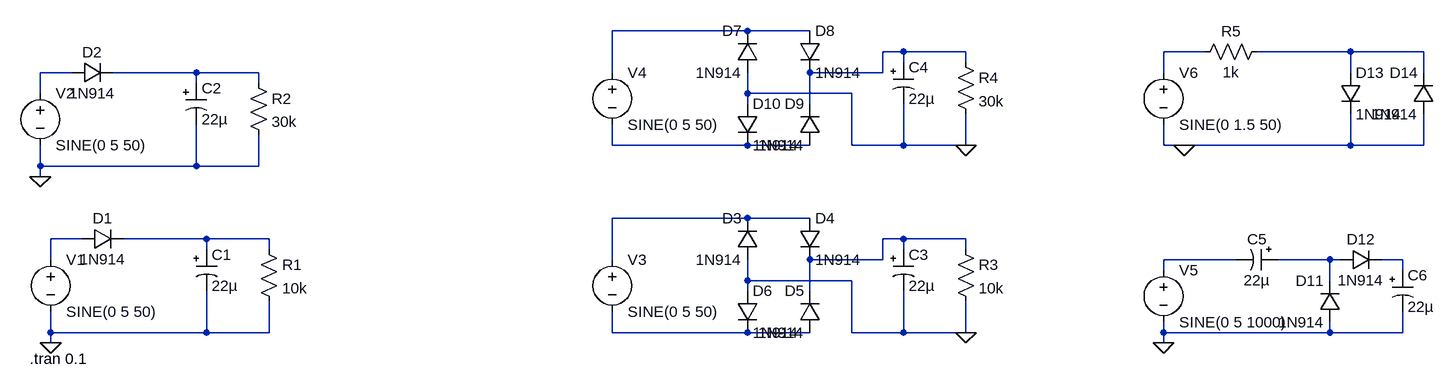
[diagram p0: schematic Lab2.asc]
Lab2.asc, the LTspice schematic file:
Version 4
SHEET 1 2436 680
WIRE 1040 -192 832 -192
WIRE 1136 -192 1040 -192
WIRE 1280 -160 1248 -160
WIRE 1376 -160 1280 -160
WIRE 1744 -160 1680 -160
WIRE 1968 -160 1824 -160
WIRE 2080 -160 1968 -160
WIRE 1280 -144 1280 -160
WIRE 1376 -144 1376 -160
WIRE 0 -128 -48 -128
WIRE 192 -128 64 -128
WIRE 288 -128 192 -128
WIRE 832 -128 832 -192
WIRE 1248 -128 1248 -160
WIRE 1248 -128 1136 -128
WIRE 1680 -128 1680 -160
WIRE 1968 -128 1968 -160
WIRE 2080 -128 2080 -160
WIRE 192 -112 192 -128
WIRE 288 -112 288 -128
WIRE -48 -96 -48 -128
WIRE 1040 -96 1040 -128
WIRE 1200 -96 1040 -96
WIRE 1040 -80 1040 -96
WIRE 1136 -80 1136 -128
WIRE 832 -16 832 -48
WIRE 1040 -16 832 -16
WIRE 1136 -16 1040 -16
WIRE 1200 -16 1200 -96
WIRE 1280 -16 1280 -80
WIRE 1280 -16 1200 -16
WIRE 1376 -16 1376 -64
WIRE 1376 -16 1280 -16
WIRE 1680 -16 1680 -48
WIRE 1712 -16 1680 -16
WIRE 1968 -16 1968 -64
WIRE 1968 -16 1712 -16
WIRE 2080 -16 2080 -64
WIRE 2080 -16 1968 -16
WIRE -48 16 -48 -16
WIRE 192 16 192 -48
WIRE 192 16 -48 16
WIRE 288 16 288 -32
WIRE 288 16 192 16
WIRE -48 32 -48 16
WIRE 1040 96 832 96
WIRE 1136 96 1040 96
WIRE 16 128 -32 128
WIRE 208 128 80 128
WIRE 304 128 208 128
WIRE 1280 128 1248 128
WIRE 1376 128 1280 128
WIRE 208 144 208 128
WIRE 304 144 304 128
WIRE 1280 144 1280 128
WIRE 1376 144 1376 128
WIRE -32 160 -32 128
WIRE 832 160 832 96
WIRE 1248 160 1248 128
WIRE 1248 160 1136 160
WIRE 1792 160 1680 160
WIRE 1936 160 1856 160
WIRE 1952 160 1936 160
WIRE 2048 160 2016 160
WIRE 1680 176 1680 160
WIRE 2048 176 2048 160
WIRE 1040 192 1040 160
WIRE 1200 192 1040 192
WIRE 1936 192 1936 160
WIRE 1040 208 1040 192
WIRE 1136 208 1136 160
WIRE -32 272 -32 240
WIRE 208 272 208 208
WIRE 208 272 -32 272
WIRE 304 272 304 224
WIRE 304 272 208 272
WIRE 832 272 832 240
WIRE 1040 272 832 272
WIRE 1136 272 1040 272
WIRE 1200 272 1200 192
WIRE 1280 272 1280 208
WIRE 1280 272 1200 272
WIRE 1376 272 1376 224
WIRE 1376 272 1280 272
WIRE 1680 272 1680 256
WIRE 1936 272 1936 256
WIRE 1936 272 1680 272
WIRE 2048 272 2048 240
WIRE 2048 272 1936 272
WIRE -32 288 -32 272
WIRE 1680 288 1680 272
FLAG -32 288 0
FLAG -48 32 0
FLAG 1376 272 0
FLAG 1376 -16 0
FLAG 1680 288 0
FLAG 1712 -16 0
SYMBOL voltage -32 144 R0
WINDOW 123 0 0 Left 0
WINDOW 39 0 0 Left 0
SYMATTR InstName V1
SYMATTR Value SINE(0 5 50)
SYMBOL diode 16 144 R270
WINDOW 0 32 32 VTop 2
WINDOW 3 0 32 VBottom 2
SYMATTR InstName D1
SYMATTR Value 1N914
SYMBOL res 288 128 R0
SYMATTR InstName R1
SYMATTR Value 10k
SYMBOL polcap 192 144 R0
WINDOW 3 24 56 Left 2
SYMATTR Value 22µ
SYMATTR InstName C1
SYMATTR Description Capacitor
SYMATTR Type cap
SYMATTR SpiceLine V=16 Irms=0 Rser=1.6 Lser=0 mfg="AVX" pn="TAJC226K016" type="Tantalum"
SYMBOL voltage -48 -112 R0
WINDOW 123 0 0 Left 0
WINDOW 39 0 0 Left 0
SYMATTR InstName V2
SYMATTR Value SINE(0 5 50)
SYMBOL diode 0 -112 R270
WINDOW 0 32 32 VTop 2
WINDOW 3 0 32 VBottom 2
SYMATTR InstName D2
SYMATTR Value 1N914
SYMBOL res 272 -128 R0
SYMATTR InstName R2
SYMATTR Value 30k
SYMBOL polcap 176 -112 R0
WINDOW 3 24 56 Left 2
SYMATTR Value 22µ
SYMATTR InstName C2
SYMATTR Description Capacitor
SYMATTR Type cap
SYMATTR SpiceLine V=16 Irms=0 Rser=1.6 Lser=0 mfg="AVX" pn="TAJC226K016" type="Tantalum"
SYMBOL voltage 832 144 R0
WINDOW 123 0 0 Left 0
WINDOW 39 0 0 Left 0
SYMATTR InstName V3
SYMATTR Value SINE(0 5 50)
SYMBOL diode 1056 160 R180
WINDOW 0 24 64 Left 2
WINDOW 3 24 0 Left 2
SYMATTR InstName D3
SYMATTR Value 1N914
SYMBOL res 1360 128 R0
SYMATTR InstName R3
SYMATTR Value 10k
SYMBOL polcap 1264 144 R0
WINDOW 3 24 56 Left 2
SYMATTR Value 22µ
SYMATTR InstName C3
SYMATTR Description Capacitor
SYMATTR Type cap
SYMATTR SpiceLine V=16 Irms=0 Rser=1.6 Lser=0 mfg="AVX" pn="TAJC226K016" type="Tantalum"
SYMBOL diode 1120 96 R0
SYMATTR InstName D4
SYMATTR Value 1N914
SYMBOL diode 1152 272 R180
WINDOW 0 24 64 Left 2
WINDOW 3 24 0 Left 2
SYMATTR InstName D5
SYMATTR Value 1N914
SYMBOL diode 1024 208 R0
SYMATTR InstName D6
SYMATTR Value 1N914
SYMBOL voltage 832 -144 R0
WINDOW 123 0 0 Left 0
WINDOW 39 0 0 Left 0
SYMATTR InstName V4
SYMATTR Value SINE(0 5 50)
SYMBOL diode 1056 -128 R180
WINDOW 0 24 64 Left 2
WINDOW 3 24 0 Left 2
SYMATTR InstName D7
SYMATTR Value 1N914
SYMBOL res 1360 -160 R0
SYMATTR InstName R4
SYMATTR Value 30k
SYMBOL polcap 1264 -144 R0
WINDOW 3 24 56 Left 2
SYMATTR Value 22µ
SYMATTR InstName C4
SYMATTR Description Capacitor
SYMATTR Type cap
SYMATTR SpiceLine V=16 Irms=0 Rser=1.6 Lser=0 mfg="AVX" pn="TAJC226K016" type="Tantalum"
SYMBOL diode 1120 -192 R0
SYMATTR InstName D8
SYMATTR Value 1N914
SYMBOL diode 1152 -16 R180
WINDOW 0 24 64 Left 2
WINDOW 3 24 0 Left 2
SYMATTR InstName D9
SYMATTR Value 1N914
SYMBOL diode 1024 -80 R0
SYMATTR InstName D10
SYMATTR Value 1N914
SYMBOL voltage 1680 160 R0
WINDOW 123 0 0 Left 0
WINDOW 39 0 0 Left 0
SYMATTR InstName V5
SYMATTR Value SINE(0 5 1000)
SYMBOL diode 1952 256 R180
WINDOW 0 24 64 Left 2
WINDOW 3 24 0 Left 2
SYMATTR InstName D11
SYMATTR Value 1N914
SYMBOL polcap 1856 144 R90
WINDOW 0 0 32 VBottom 2
WINDOW 3 32 32 VTop 2
SYMATTR InstName C5
SYMATTR Value 22µ
SYMATTR Description Capacitor
SYMATTR Type cap
SYMATTR SpiceLine V=16 Irms=0 Rser=1.6 Lser=0 mfg="AVX" pn="TAJC226K016" type="Tantalum"
SYMBOL diode 1952 176 R270
WINDOW 0 32 32 VTop 2
WINDOW 3 0 32 VBottom 2
SYMATTR InstName D12
SYMATTR Value 1N914
SYMBOL polcap 2032 176 R0
SYMATTR InstName C6
SYMATTR Value 22µ
SYMATTR Description Capacitor
SYMATTR Type cap
SYMATTR SpiceLine V=16 Irms=0 Rser=1.6 Lser=0 mfg="AVX" pn="TAJC226K016" type="Tantalum"
SYMBOL voltage 1680 -144 R0
WINDOW 123 0 0 Left 0
WINDOW 39 0 0 Left 0
SYMATTR InstName V6
SYMATTR Value SINE(0 1.5 50)
SYMBOL res 1840 -176 R90
WINDOW 0 0 56 VBottom 2
WINDOW 3 32 56 VTop 2
SYMATTR InstName R5
SYMATTR Value 1k
SYMBOL diode 1952 -128 R0
SYMATTR InstName D13
SYMATTR Value 1N914
SYMBOL diode 2096 -64 R180
WINDOW 0 24 64 Left 2
WINDOW 3 24 0 Left 2
SYMATTR InstName D14
SYMATTR Value 1N914
TEXT -64 312 Left 2 !.tran 0.1

The netlist it stands for:
* Lab2.asc
V1 N009 0 SINE(0 5 50)
D1 N009 N010 1N914
R1 N010 0 10k
C1 N010 0 22µ V=16 Irms=0 Rser=1.6 Lser=0 mfg="AVX" pn="TAJC226K016" type="Tantalum"
V2 N005 0 SINE(0 5 50)
D2 N005 N006 1N914
R2 N006 0 30k
C2 N006 0 22µ V=16 Irms=0 Rser=1.6 Lser=0 mfg="AVX" pn="TAJC226K016" type="Tantalum"
V3 N008 N015 SINE(0 5 50)
D3 0 N008 1N914
R3 N011 0 10k
C3 N011 0 22µ V=16 Irms=0 Rser=1.6 Lser=0 mfg="AVX" pn="TAJC226K016" type="Tantalum"
D4 N008 N011 1N914
D5 N015 N011 1N914
D6 0 N015 1N914
V4 N001 N007 SINE(0 5 50)
D7 0 N001 1N914
R4 N002 0 30k
C4 N002 0 22µ V=16 Irms=0 Rser=1.6 Lser=0 mfg="AVX" pn="TAJC226K016" type="Tantalum"
D8 N001 N002 1N914
D9 N007 N002 1N914
D10 0 N007 1N914
V5 N012 0 SINE(0 5 1000)
D11 0 N013 1N914
C5 N013 N012 22µ V=16 Irms=0 Rser=1.6 Lser=0 mfg="AVX" pn="TAJC226K016" type="Tantalum"
D12 N013 N014 1N914
C6 N014 0 22µ V=16 Irms=0 Rser=1.6 Lser=0 mfg="AVX" pn="TAJC226K016" type="Tantalum"
V6 N003 0 SINE(0 1.5 50)
R5 N004 N003 1k
D13 N004 0 1N914
D14 0 N004 1N914
.model D D
.lib standard.dio
.tran 0.1
.backanno
.end